# Altium schematic sheet SolVoeding.SchDoc
size A4; SheetNumber: 4; SheetTotal: 6
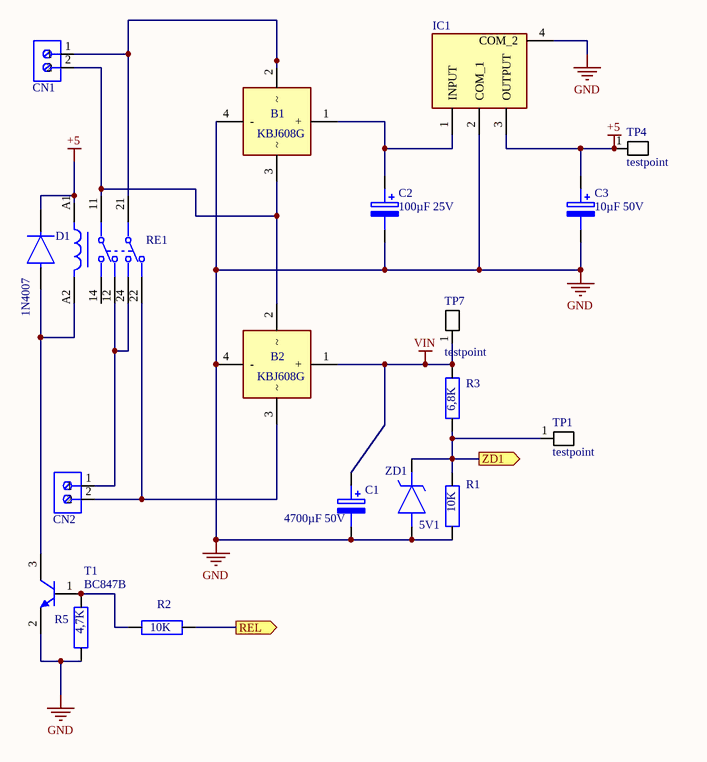
[diagram p0: SolVoeding.SchDoc]

## Parts
B1  KBJ608G  [TO750P480X2500X1900-4P]
B2  KBJ608G  [TO750P480X2500X1900-4P]
C1  4700µF 50V  [Capacitor4700]
C2  100µF 25V  [caprad100mil]
C3  10µF 50V  [caprad100mil]
CN1  282836-2  [cnn2pin]  (value not drawn)
CN2  282836-2  [cnn2pin]  (value not drawn)
D1  1N4007  [FP-1N4007-MFG]
IC1  TL780-05CKTTR  [TL78005CKTTR]  (value not drawn)
R1  10K  [res0805ph]
R2  10K  [res0805ph]
R3  6,8K  [res0805ph]
R5  4,7K  [res0805ph]
RE1  RT424615  [FP-RT424615-MFG]  (value not drawn)
T1  BC847B  [sot23]
TP1  testpoint  [testpin]
TP4  testpoint  [testpin]
TP7  testpoint  [testpin]
ZD1  5V1  [DIOAD1068W53L380D172]

## Ports
REL (out), ZD1 (out)

## Nets
+5: C3.1(+) D1.1(C) IC1.3(OUTPUT) RE1.A1 TP4.1(TP)
GND: B1.4(-) B2.4(-) C1.2(-) C2.2(-) C3.2(-) IC1.2(COM_1) IC1.4(COM_2) R1.1 R5.2 T1.2(E) ZD1.2(A)
VIN: B2.1(+) C1.1(+) R3.1 TP7.1(TP)
REL: R2.2 ; port REL
ZD1: R1.2 R3.2 TP1.1(TP) ZD1.1(K) ; port ZD1
NetB1_1: B1.1(+) C2.1(+) IC1.1(INPUT)
NetB1_2: B1.2 CN1.1 RE1.21
NetB1_3: B1.3 B2.2 CN1.2 RE1.11
NetB2_3: B2.3 CN2.2 RE1.22
NetCN2_1: CN2.1 RE1.12 RE1.24
NetD1_2: D1.2(A) RE1.A2 T1.3(C)
NetR2_1: R2.1 R5.1 T1.1(B)

Not connected (* = marked no-connect by the designer): RE1 14

## Library data of the parts
B1 B2 = KBJ608G: Bridge Rectifier; Manufacturer_Name: Diodes Inc.; Datasheet Link: https://componentsearchengine.com//KBJ608G.pdf; Height: 4.8mm; Mouser2 Part Number: 621-KBJ608G; Mouser2 Price/Stock: https://www.mouser.com/Search/Refine.aspx?Keyword=621-KBJ608G; Manufacturer_Part_Number: KBJ608G
C1 = ELCO4700uF: Capacitor Polarised; Manufacturer_Name: Kemet; Manufacturer_Part_Number: T494D227K006AT; Datasheet Link: https://datasheet.datasheetarchive.com/originals/distributors/Datasheets-DGA21/1893029.pdf; Height: 3.1mm; Mouser Part Number: 80-T494D227K006; Mouser Price/Stock: https://www.mouser.co.uk/ProductDetail/KEMET/T494D227K006AT/?qs=KZyWKl2lJVCDSHmnBye8LQ%3D%3D
C2 C3 = ELCO220uF: Capacitor Polarised; Manufacturer_Name: Kemet; Manufacturer_Part_Number: T494D227K006AT; Datasheet Link: https://datasheet.datasheetarchive.com/originals/distributors/Datasheets-DGA21/1893029.pdf; Height: 3.1mm; Mouser Part Number: 80-T494D227K006; Mouser Price/Stock: https://www.mouser.co.uk/ProductDetail/KEMET/T494D227K006AT/?qs=KZyWKl2lJVCDSHmnBye8LQ%3D%3D
CN1 CN2 = CNN2P: Female Header, Pitch 5 mm, 1 x 2 Position, Height 10 mm, Tail Length 3.5 mm, Rohs, Bulk; Manufacturer: TE Connectivity; Wire Gauge: 16-30AWG; Product Training Modules: Wire-to-BoardEurostyleTerminalBlocks; Clamp Material - Plating: Brass-NickelPlated; Voltage: 300V; Mating Orientation: HorizontalwithBoard; Current: 13.5A; Pitch: 0.197"(5.00mm); Screw Thread: M3; 3D Model: 282836-2.pdf; Other Names: 5ULV-02B / A98076; Dynamic Catalog: BuchananSeries; Number of Levels: 1; Torque - Screw: 0.68Nm(6Lb-In); Featured Product: EurostyleTerminalBlockConnectors; Positions Per Level: 2; Wire Termination: Screw-RisingCageClamp; Datasheet URL: http://www.te.com.cn/commerce/DocumentDelivery/DDEController?Action=showdoc&DocId=Catalog+Section%7F1308389_EUROSTYLE_TERMINAL_BLOCKS%7F0607%7Fpdf%7FEnglish%7FENG_CS_1308389_EUROSTYLE_TERMINAL_BLOCKS_0607.pdf%7F282836-2; Color: Green; Family: TerminalBlocks-WiretoBoard; RoHS Information: 282836-2StatementofCompliance; Standard Package: 300; Contact Material - Plating: Brass-TinPlated; Manufacturer URL: http://www.te.com; Housing Material: Polyamide(PA66),Nylon6/6; Features: Interlocking(Side); Package Description: Female Header, Pitch 5 mm, 1 x 2 Position, Height 10 mm, Tail Length 3.5 mm; Mounting Type: ThroughHole; Package Reference: THD; Packaging: Bulk; Series: Buchanan; Category: Connectors,Interconnects; Screw Material - Plating: Brass-NickelPlated
D1 = CMP-123542-000001-1: Rectifier diode 1000 V 1 A DO-41, ,; Manufacturer: Diotec; Max Surge Forward Current: 27A; Forward Current: 1A; Max Junction Temp: +175°C; Reverse Voltage: 1000V; Value: 15pF; Peak Reverse Current: 5uA; Category: Diode; Temperature Range Low: -50°C; Automotive: No; Temperature: -50°C to +175°C; Lead Free: Yes; ComponentLink2Description: Datasheet; Max Repetitive Reverse Voltage: 1000V; ComponentLink2URL: https://datasheet.octopart.com/1N4007-Diotec-datasheet-62346875.pdf; Manufacturer Part Number: 1N4007; Device Class L3: Rectifier Diodes; Height: 2.8mm; Octopart: https://octopart.com/1n4007-diotec-4040411; Package: 1N4007; Temperature Range High: +175°C; Device Class L1: Discrete Semiconductors; Device Class L2: Diodes; RoHS: TRUE; Capacitance: 15pF; Ipc Land Pattern Name: DIOAD888W100L520D280
IC1 = TL780-05CKTTR: Integrated Circuit; Manufacturer_Name: Texas Instruments; Datasheet Link: http://www.ti.com/general/docs/suppproductinfo.tsp?distId=26&gotoUrl=http%3A%2F%2Fwww.ti.com%2Flit%2Fgpn%2Ftl780; Height: 5.08mm; Manufacturer_Part_Number: TL780-05CKTTR
R1-R3 R5 = Res: Resistor; Manufacturer_Name: TE Connectivity; Manufacturer_Part_Number: CPF0201D10K2C1; Datasheet Link: http://www.te.com/commerce/DocumentDelivery/DDEController?Action=showdoc&DocId=Data+Sheet%7F1773200-1%7FA%7Fpdf%7FEnglish%7FENG_DS_1773200-1_A.pdf%7F4-2176215-6; Height: 0.28mm; Mouser Part Number: N/A; Mouser Price/Stock: https://www.mouser.com/Search/Refine.aspx?Keyword=N%2FA
RE1 = CMP-03395-000241-1: RELAY GEN PURPOSE DPDT 8A 115V; Max Current Rating: 15A; Ratings: IP54; Coil Type: Non-Latching; Power Rating: 760mW; Max Voltage Rating (AC): 400V; Coil Resistance: 8.1kR; Operate Time: 8ms; Approvals: CSA; Application(s): POWER; Relay Type: General Purpose; Switching Capacity: 2kW; Length: 29mm; Switching Current: 8A; Mount: Through Hole; Contact Current Rating: 8A; Coil Voltage (AC): 115V; Voltage Rating (AC): 400V; Width: 12.7mm; Radiation Hardening: No; Case/Package: DIP; Current Rating: 8A; Number of Pins: 8; Height: 15.7mm; Series: RT2, SCHRACK; Throw Configuration: DPDT; Packaging: Rail/Tube; Package Quantity: 500; Min Operating Temperature: -40°C; Termination: PC Pin; RoHS Compliant: Yes; Depth: 12.7mm; Max Operating Temperature: 70°C; Contact Material: Silver
T1 = BC847: NPN Silicon AF Transistor, 45 V VCEO, 100 mA IC, SOT23, Reel, Green; Manufacturer: Infineon; VEBO (max): 6Â V; ICBO (max): 15Â nA; VCBO (max): 50Â V; IBM (max): 200Â mA; Green: TRUE; Ptot (max): 330Â mW; fT (typ): 250Â MHz; IC (max): 100Â mA; VCEO (max): 45Â V; PackageDescription: 3-Pin Small Outline Transistor Package, 1.3 x 2.9 mm Body, 0.95 mm Pitch; ComponentLink3URL: http://www.infineon.com/dgdl/SOT23-Package_Overview.pdf?folderId=db3a30431936bc4b0119532290053c66&fileId=db3a30431936bc4b0119533468123c85; PackageVersion: Apr-08; Packing: Reel; ComponentLink3Description: Package Specification; ComponentLink2URL: http://www.infineon.com/dgdl/bc847series_bc848series_bc849series_bc850series.pdf?folderId=db3a304314dca389011541d30fa21656&fileId=db3a304314dca389011541d4630a1657; ComponentLink1URL: http://www.infineon.com/; ComponentLink2Description: Datasheet; Polarity: NPN; Mounting Technology: Surface Mount; PackageReference: SOT23; ICM (max): 200Â mA; ComponentLink1Description: Manufacturer URL; PartNumber: BC847B
ZD1 = BZX79C3V3: Zener Diode; Manufacturer_Name: ON Semiconductor; Manufacturer_Part_Number: BZX79C6V8; Datasheet Link: https://www.onsemi.com/pub/Collateral/BZX79C2V4-D.PDF; Mouser Part Number: 512-BZX79C6V8; Mouser Price/Stock: https://www.mouser.co.uk/ProductDetail/ON-Semiconductor-Fairchild/BZX79C6V8?qs=G5AQjGfRJcK7HFctFTHqog%3D%3D; Arrow Part Number: BZX79C6V8; Arrow Price/Stock: https://www.arrow.com/en/products/bzx79c6v8/on-semiconductor